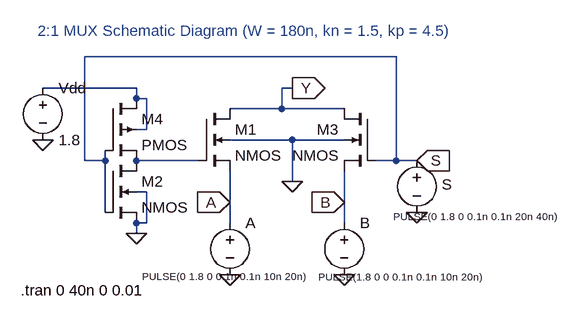
[diagram p0: schematic mux-2x1.asc]
mux-2x1.asc, the LTspice schematic file:
Version 4
SHEET 1 880 680
WIRE 384 48 -96 48
WIRE -16 96 -160 96
WIRE 224 96 208 96
WIRE -16 112 -16 96
WIRE 0 112 -16 112
WIRE 208 128 208 96
WIRE 208 128 128 128
WIRE 304 128 208 128
WIRE 0 160 0 112
WIRE 0 160 -16 160
WIRE 224 176 128 176
WIRE 304 176 224 176
WIRE -96 208 -96 48
WIRE -64 208 -64 192
WIRE -64 208 -96 208
WIRE 80 208 -16 208
WIRE 384 208 384 48
WIRE 384 208 352 208
WIRE 416 208 384 208
WIRE 224 240 224 176
WIRE 0 256 -16 256
WIRE 128 272 128 224
WIRE 304 272 304 224
WIRE -64 288 -64 208
WIRE 0 304 0 256
WIRE 0 304 -16 304
WIRE 128 304 128 272
WIRE 304 304 304 272
WIRE -16 320 -16 304
FLAG 224 240 0
FLAG -16 320 0
FLAG 128 384 0
FLAG 304 384 0
FLAG 416 288 0
FLAG -160 176 0
FLAG 224 96 Y
IOPIN 224 96 Out
FLAG 128 272 A
IOPIN 128 272 In
FLAG 304 272 B
IOPIN 304 272 In
FLAG 416 208 S
IOPIN 416 208 In
SYMBOL nmos4 80 128 R0
SYMATTR InstName M1
SYMATTR Value2 l=180n w=270n
SYMBOL nmos4 352 128 M0
SYMATTR InstName M3
SYMATTR Value2 l=180n w=270n
SYMBOL nmos4 -64 208 R0
SYMATTR InstName M2
SYMATTR Value2 l=180n w=270n
SYMBOL pmos4 -64 112 R0
SYMATTR InstName M4
SYMATTR Value2 l=180n w=810n
SYMBOL voltage 416 192 R0
WINDOW 0 38 53 Left 2
WINDOW 3 -36 102 Left 1
WINDOW 123 0 0 Left 0
WINDOW 39 0 0 Left 0
SYMATTR InstName S
SYMATTR Value PULSE(0 1.8 0 0.1n 0.1n 20n 40n)
SYMBOL voltage -160 80 R0
WINDOW 123 0 0 Left 0
WINDOW 39 0 0 Left 0
SYMATTR InstName Vdd
SYMATTR Value 1.8
SYMBOL voltage 128 288 R0
WINDOW 3 -135 98 Left 1
WINDOW 123 0 0 Left 0
WINDOW 39 0 0 Left 0
SYMATTR InstName A
SYMATTR Value PULSE(0 1.8 0 0.1n 0.1n 10n 20n)
SYMBOL voltage 304 288 R0
WINDOW 3 -40 99 Left 1
WINDOW 123 0 0 Left 0
WINDOW 39 0 0 Left 0
SYMATTR InstName B
SYMATTR Value PULSE(1.8 0 0 0.1n 0.1n 10n 20n)
TEXT -194 408 Left 2 !.tran 0 40n 0 0.01
TEXT -168 8 Left 2 ;2:1 MUX Schematic Diagram (W = 180n, kn = 1.5, kp = 4.5)

The netlist it stands for:
* mux-2x1.asc
M1 Y N002 A 0 NMOS l=180n w=270n
M3 Y S B 0 NMOS l=180n w=270n
M2 N002 S 0 0 NMOS l=180n w=270n
M4 N001 S N002 N001 PMOS l=180n w=810n
V§S S 0 PULSE(0 1.8 0 0.1n 0.1n 20n 40n)
Vdd N001 0 1.8
V§A A 0 PULSE(0 1.8 0 0.1n 0.1n 10n 20n)
V§B B 0 PULSE(1.8 0 0 0.1n 0.1n 10n 20n)
.model NMOS NMOS
.model PMOS PMOS
.lib standard.mos
.tran 0 40n 0 0.01
* 2:1 MUX Schematic Diagram (W = 180n, kn = 1.5, kp = 4.5)
.backanno
.end